# Altium schematic sheet IR18T38.SchDoc
size A; SheetNumber: 7; SheetTotal: 9
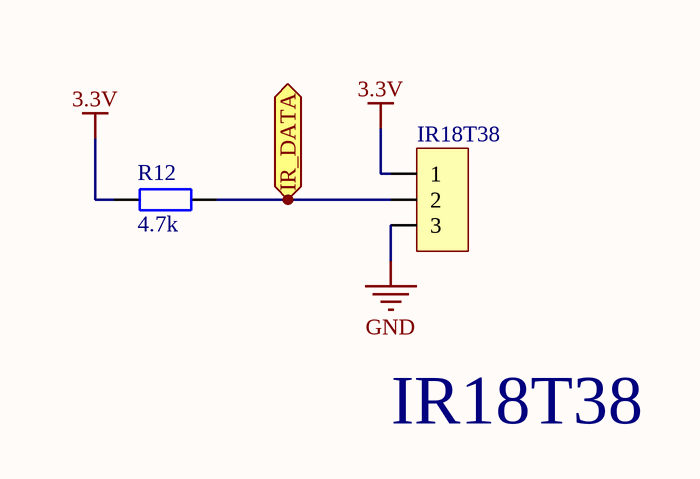
[diagram p0: IR18T38.SchDoc]

## Parts
IR18T38  JP 1x3 2.54  [JP 1x3 CT]  (value not drawn)
R12  4.7k  [tro smd 0603]

## Ports
IR_DATA (bidir)

## Nets
3.3V: IR18T38.1 R12.1
GND: IR18T38.3
IR_DATA: IR18T38.2 R12.2 ; port IR_DATA

## Notes on the sheet
- IR18T38

## Library data of the parts
IR18T38 = JP 1x3 2.54 Cai Thang: Cắm; Ten_Linh_Kien: Jump Đơn Cái 2.54MM 1x20P Thẳng; Don_Vi: Con; Ma_Hang: MH004006; Ghi_Chu: *; Kieu_Chan: *; Chung_Loai: Cắm
R12 = Tro 0603 5% 4.7k: Dán; Don_Vi: Con; So_Chan: 2; Ten_Linh_Kien: Trở 0603 5% 4.7k; Ma_Hang: MH006327; Chung_Loai: Dán; Kieu_Chan: *